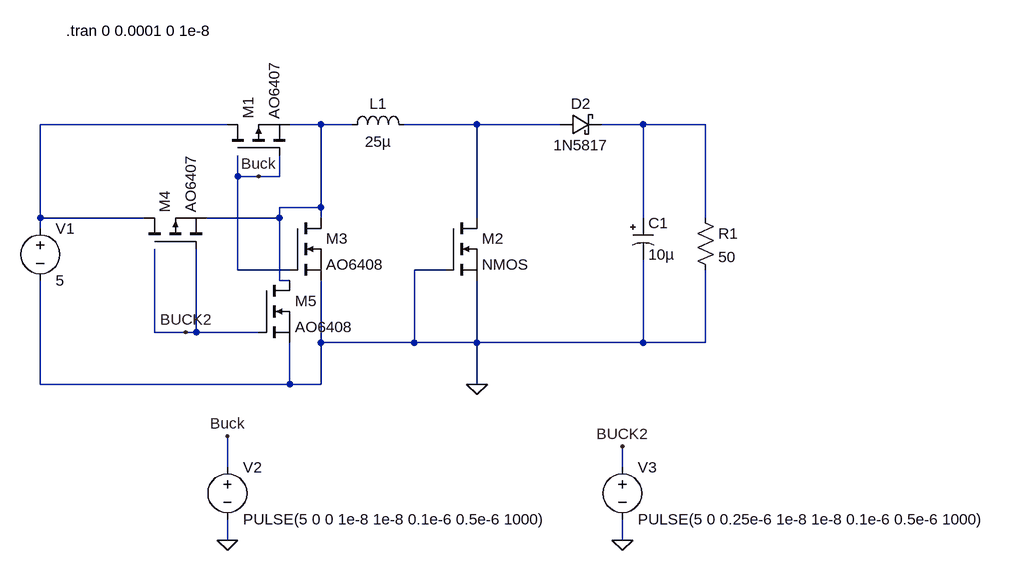
[diagram p0: schematic DC-DC converter.asc]
DC-DC converter.asc, the LTspice schematic file:
Version 4
SHEET 1 1444 708
WIRE 208 48 -80 48
WIRE 352 48 304 48
WIRE 400 48 352 48
WIRE 592 48 480 48
WIRE 720 48 592 48
WIRE 848 48 784 48
WIRE 944 48 848 48
WIRE 224 128 224 96
WIRE 256 128 224 128
WIRE 288 128 288 96
WIRE 288 128 256 128
WIRE 352 176 352 48
WIRE 352 176 288 176
WIRE -80 192 -80 48
WIRE 80 192 -80 192
WIRE 288 192 288 176
WIRE 288 192 176 192
WIRE 352 192 352 176
WIRE 592 192 592 48
WIRE 848 192 848 48
WIRE 944 192 944 48
WIRE -80 208 -80 192
WIRE 224 272 224 128
WIRE 304 272 224 272
WIRE 544 272 496 272
WIRE 288 288 288 192
WIRE 304 288 288 288
WIRE 96 368 96 240
WIRE 144 368 96 368
WIRE 160 368 160 240
WIRE 160 368 144 368
WIRE 256 368 160 368
WIRE 352 384 352 288
WIRE 496 384 496 272
WIRE 496 384 352 384
WIRE 592 384 592 288
WIRE 592 384 496 384
WIRE 848 384 848 256
WIRE 848 384 592 384
WIRE 944 384 944 272
WIRE 944 384 848 384
WIRE -80 448 -80 288
WIRE 304 448 304 384
WIRE 304 448 -80 448
WIRE 352 448 352 384
WIRE 352 448 304 448
WIRE 592 448 592 384
WIRE 208 576 208 528
WIRE 816 576 816 544
WIRE 208 688 208 656
WIRE 816 688 816 656
FLAG 592 448 0
FLAG 256 128 Buck
FLAG 208 528 Buck
FLAG 208 688 0
FLAG 144 368 BUCK2
FLAG 816 544 BUCK2
FLAG 816 688 0
SYMBOL pmos 208 96 R270
SYMATTR InstName M1
SYMATTR Value AO6407
SYMBOL nmos 544 192 R0
SYMATTR InstName M2
SYMBOL schottky 720 64 R270
WINDOW 0 32 32 VTop 2
WINDOW 3 0 32 VBottom 2
SYMATTR InstName D2
SYMATTR Value 1N5817
SYMATTR Description Diode
SYMATTR Type diode
SYMBOL polcap 832 192 R0
WINDOW 3 24 56 Left 2
SYMATTR InstName C1
SYMATTR Value 10µ
SYMATTR Description Capacitor
SYMATTR Type cap
SYMATTR SpiceLine V=6.3 Irms=0 Rser=4 Lser=0
SYMBOL ind 384 64 R270
WINDOW 0 32 56 VTop 2
WINDOW 3 5 56 VBottom 2
SYMATTR InstName L1
SYMATTR Value 25µ
SYMATTR SpiceLine Ipk=10 Rser=0.015 Rpar=37000 Cpar=7.41p mfg="Gowanda" pn="894AT2502V"
SYMBOL res 928 176 R0
SYMATTR InstName R1
SYMATTR Value 50
SYMBOL voltage -80 192 R0
WINDOW 123 0 0 Left 2
WINDOW 39 0 0 Left 2
SYMATTR InstName V1
SYMATTR Value 5
SYMBOL voltage 208 560 R0
WINDOW 123 0 0 Left 2
WINDOW 39 0 0 Left 2
SYMATTR InstName V2
SYMATTR Value PULSE(5 0 0 1e-8 1e-8 0.1e-6 0.5e-6 1000)
SYMBOL nmos 304 192 R0
SYMATTR InstName M3
SYMATTR Value AO6408
SYMBOL pmos 80 240 R270
SYMATTR InstName M4
SYMATTR Value AO6407
SYMBOL nmos 256 288 R0
SYMATTR InstName M5
SYMATTR Value AO6408
SYMBOL voltage 816 560 R0
WINDOW 123 0 0 Left 2
WINDOW 39 0 0 Left 2
SYMATTR InstName V3
SYMATTR Value PULSE(5 0 0.25e-6 1e-8 1e-8 0.1e-6 0.5e-6 1000)
TEXT -40 -96 Left 2 !.tran 0 0.0001 0 1e-8

The netlist it stands for:
* DC-DC converter.asc
M1 N001 Buck N002 N002 AO6407
M2 N003 0 0 0 NMOS
D2 N003 N004 1N5817
C1 N004 0 10µ V=6.3 Irms=0 Rser=4 Lser=0
L1 N002 N003 25µ Ipk=10 Rser=0.015 Rpar=37000 Cpar=7.41p mfg="Gowanda" pn="894AT2502V"
R1 N004 0 50
V1 N001 0 5
V2 Buck 0 PULSE(5 0 0 1e-8 1e-8 0.1e-6 0.5e-6 1000)
M3 N002 Buck 0 0 AO6408
M4 N001 BUCK2 N002 N002 AO6407
M5 N002 BUCK2 0 0 AO6408
V3 BUCK2 0 PULSE(5 0 0.25e-6 1e-8 1e-8 0.1e-6 0.5e-6 1000)
.model D D
.lib standard.dio
.model NMOS NMOS
.model PMOS PMOS
.lib standard.mos
.tran 0 0.0001 0 1e-8
.backanno
.end